# EAGLE design LB_BIT_oX_1IN_1OUT-XXL-v03(1_1x) (EAGLE 6.5.0)
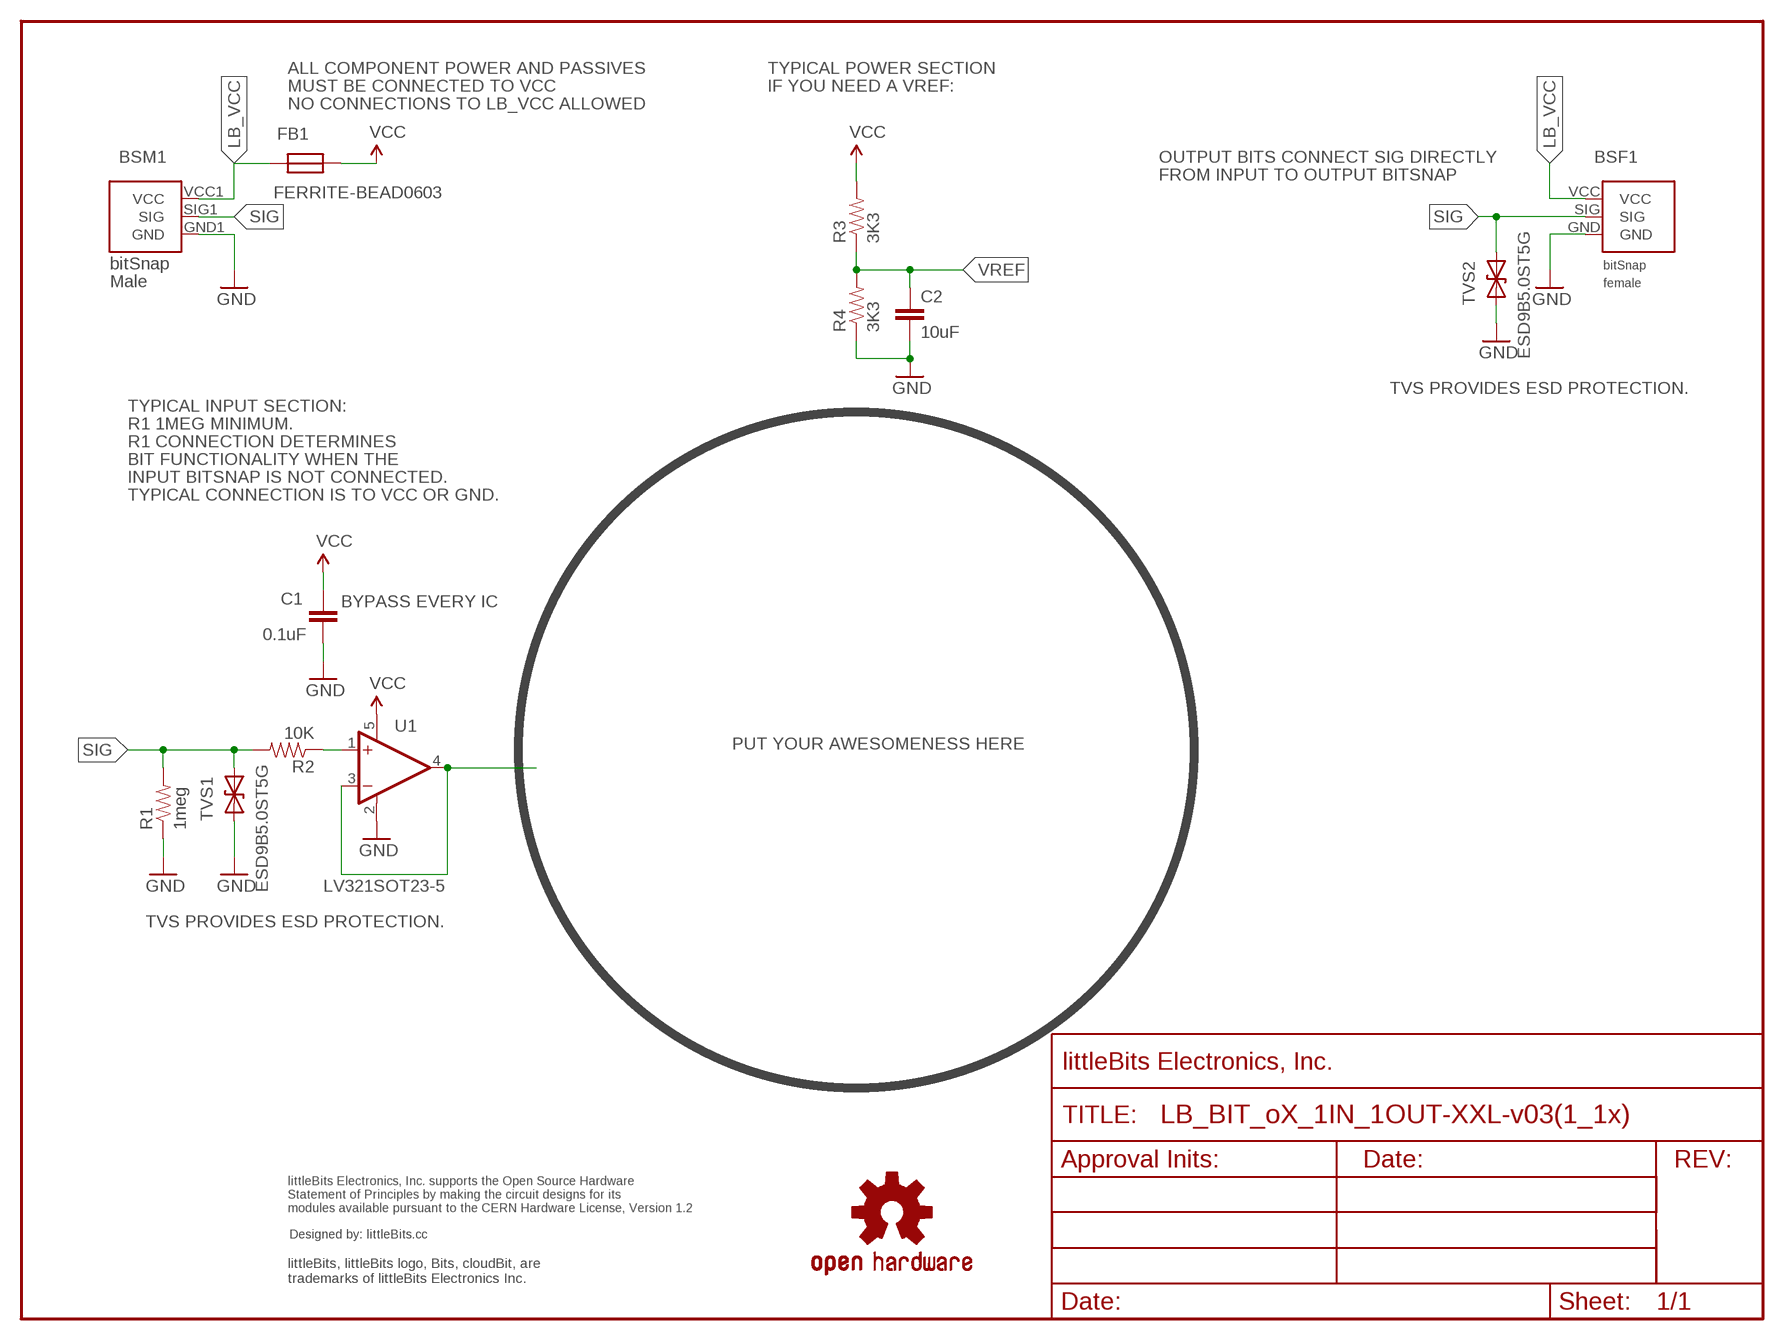
[diagram p0: schematic, sheet 1]

## Parts
BSF1  BITSNAP_V03_FEMALE  [BITSNAP_V03_FEMALE]
BSM1  BITSNAP_V03_MALE  [BITSNAP_V03_MALE]
C1  0.1uF  CAPCAP-0603  [CAP-0603]
C2  10uF  CAPCAP-0603  [CAP-0603]
FB1  FERRITE-BEAD0603  [R0603]
R1  1meg  RESISTOR0603  [RES-0603]
R2  10K  RESISTOR0603  [RES-0603]
R3  3K3  RESISTOR0603  [RES-0603]
R4  3K3  RESISTOR0603  [RES-0603]
TVS1  ESD9B5.0ST5G  DIODE-TVSSOD-923  [SOD-923]
TVS2  ESD9B5.0ST5G  DIODE-TVSSOD-923  [SOD-923]
U1  LV321SOT23-5  [SOT23-5]
U$1  OSHW-LOGOL  [OSHW-LOGO-L]
U$2  OSHWCREDIT  [OSHWCREDIT]
U$3  FRAME-LETTER  [FABDWG01-OHW]

## Nets
GND: BSF1.GND BSM1.GND1(GND) C1.2 C2.2 R1.1 R4.1 TVS1.1(A) TVS2.1(A) U1.2(V-)
LB_VCC: BSF1.VCC BSM1.VCC1(VCC) FB1.2
N$2: U1.3(-IN) U1.4(OUT)
N$4: R2.1 U1.1(+IN)
SIG: BSF1.SIG BSM1.SIG1(SIG) R1.2 R2.2 TVS1.2(C) TVS2.2(C)
VCC: C1.1 FB1.1 R3.2 U1.5(V+)
VREF: C2.1 R3.1 R4.2

## Notes on the sheet
- ALL COMPONENT POWER AND PASSIVES | TYPICAL POWER SECTION
- MUST BE CONNECTED TO VCC | IF YOU NEED A VREF:
- NO CONNECTIONS TO LB_VCC ALLOWED
- OUTPUT BITS CONNECT SIG DIRECTLY
- FROM INPUT TO OUTPUT BITSNAP
- TVS PROVIDES ESD PROTECTION.
- TYPICAL INPUT SECTION:
- R1 1MEG MINIMUM.
- R1 CONNECTION DETERMINES
- BIT FUNCTIONALITY WHEN THE
- INPUT BITSNAP IS NOT CONNECTED.
- TYPICAL CONNECTION IS TO VCC OR GND.
- BYPASS EVERY IC
- PUT YOUR AWESOMENESS HERE
- TVS PROVIDES ESD PROTECTION.

## Library data of the parts
BSF1 = bitSnap:BITSNAP_V03_FEMALE
BSM1 = bitSnap:BITSNAP_V03_MALE
C1 C2 = LITTLEBITS:CAP
FB1 = LITTLEBITS:FERRITE-BEAD
R1-R4 = LITTLEBITS:RESISTOR
TVS1 TVS2 = LITTLEBITS:DIODE-TVS: Bidirectional Transient Voltage Suppression Diode: Device conducts in avalanche mode after reaching a part dependent voltage threshold. Used for limiting voltage spikes on ESD sensitive inputs and outputs.; IEC_ESD_PROT0: +/-18kV; LB_PN: ?; MPN: ESD9B5.0ST5G; V_CLAMP: ?; V_OPERATION: 5V
U1 = LITTLEBITS:LV321
U$1 = LITTLEBITS131206:OSHW-LOGO: Open Source Hardware Logo This logo indicates the piece of hardware it is found on incorporates a OSHW license and/or adheres to the definition of open source hardware found here: http://freedomdefined.org/OSHW
U$2 = LITTLEBITS:OSHWCREDIT
U$3 = LITTLEBITS:FRAME-LETTER

## Board
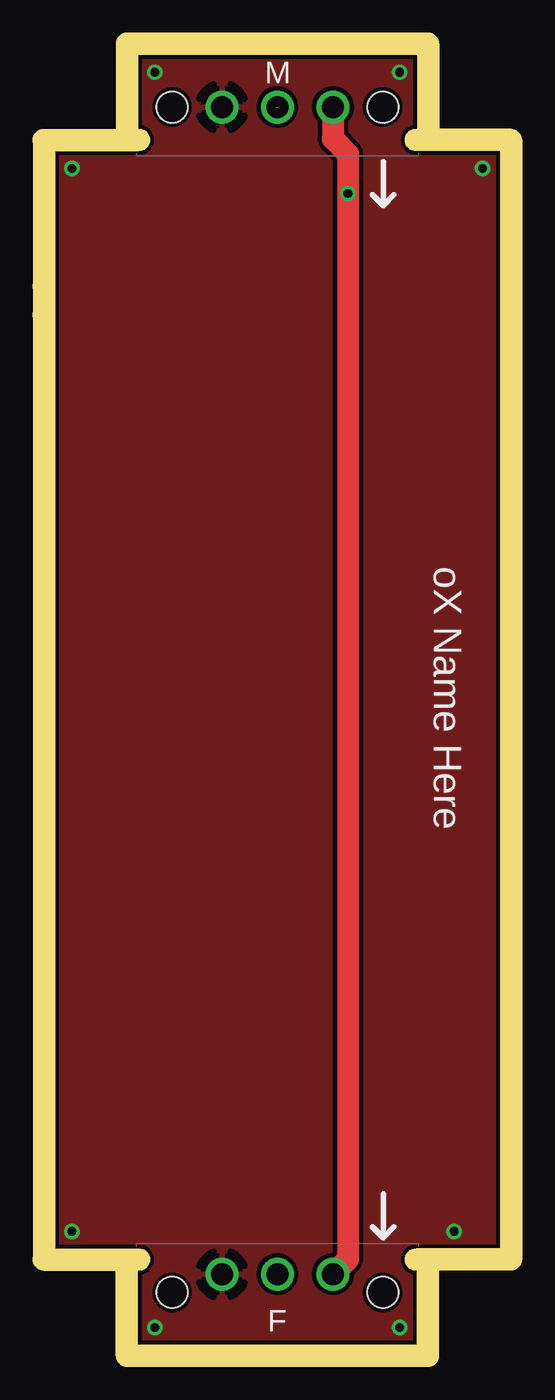
[diagram p1: board, top side]
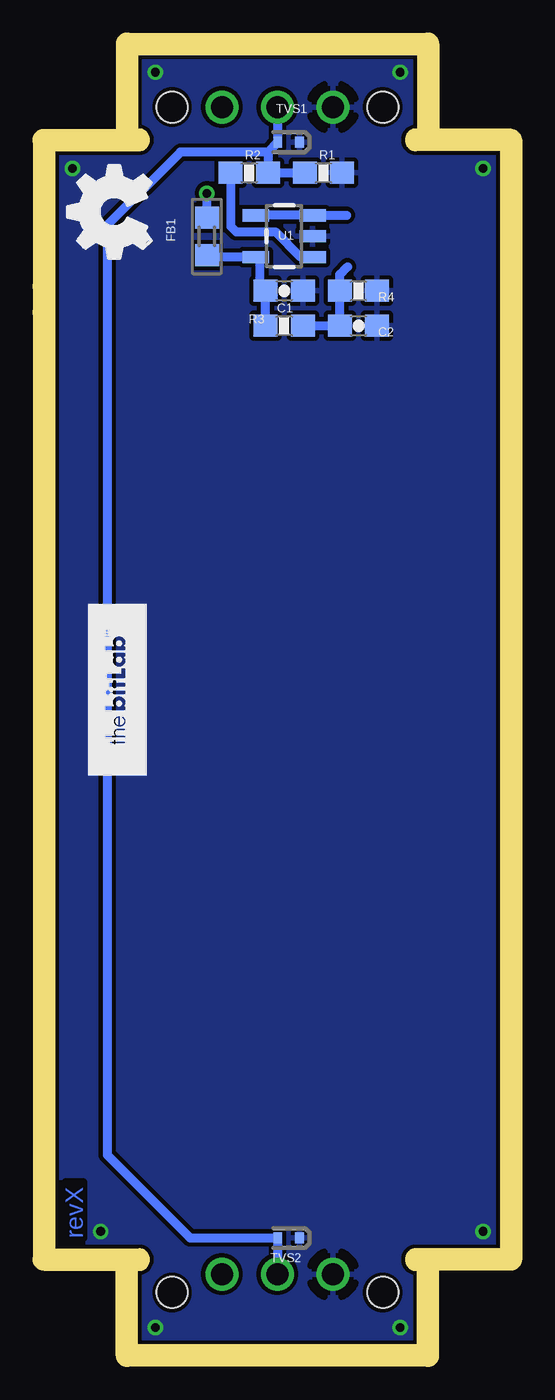
[diagram p2: board, bottom side, seen from below]

Size 20.4 x 59.02 mm. Coordinates in mm from the lower left corner, seen from the top.
Outline: 0,54.62 0,4.4
Outline: 20.4,54.62 20.4,4.4
Copper layers (1*16): Top 0.035mm / dielectric 1.5mm / Bottom 0.035mm
Design rules "default": minimum track width 0.2mm, minimum drill 0.4mm, track to track 0.2mm, track to pad 0.2mm, pad to pad 0.2mm, via to via 0.2mm, smd to smd 0mil, copper to edge 0.2mm, drill to drill 0.2mm, minimum pad ring 0.2mm, minimum via ring 0.15mm, stop-mask expansion 0.1mm, vias tented up to drill 0mil, thermal gap 0.2mm
Milling: 8 lines

### Footprints (pad centres in the part's own frame; a part is rotated, then mirrored left to right if it is on the bottom)
BITSNAP_V03_FEMALE = drill 1: GND 4.065,3.44; SIG 6.605,3.44; VCC 9.145,3.44 | hole 1.4: 1.785,2.61; 11.425,2.61
BITSNAP_V03_MALE = drill 1: GND1 9.145,2.61; SIG1 6.605,2.61; VCC1 4.065,2.61 | hole 1.4: 1.785,2.61; 11.425,2.61
CAP-0603 = smd 1.1 x 1: 1 -0.85,0; 2 0.85,0
R0603 = smd 1 x 1.1: 1 -0.85,0; 2 0.85,0
RES-0603 = smd 1.1 x 1: 1 -0.85,0; 2 0.85,0
SOD-923 = smd 0.4 x 0.5: 1 -0.5,0; 2 0.5,0
SOT23-5 = smd 0.55 x 1.2: 1 -0.95,-1.3; 2 0,-1.3; 3 0.95,-1.3; 4 0.95,1.3; 5 -0.95,1.3

### Placement (x,y rotation side)
BSF1  3.6,-0.21 0 top
BSM1  16.8,59.23 180 top
C1  9.89,48.22 0 bottom
C2  6.49,46.62 0 bottom
FB1  13.43,50.71 90 bottom
R1  8.09,53.62 180 bottom
R2  11.49,53.62 0 bottom
R3  9.89,46.62 180 bottom
R4  6.49,48.22 180 bottom
TVS1  9.69,55.02 180 bottom
TVS2  9.69,4.89 180 bottom
U1  9.89,50.72 90 bottom
U$1  -40.52,-68.43 0 top  (outside the outline)
U$2  -95.25,-64.52 0 top  (outside the outline)
U$3  -3.01,-0.21 0 top  (outside the outline)
U$4  [OSHW_FILLX150_NOTEXT]  15.99,49.71 90 bottom
U$5  [BITLAB-LOGO]  16.19,33.89 270 top

### Tracks (layer width: path | path; a pad name or v marks a point on that pad's centre or on a via)
GND  (via drill 0.4)
  other vias: 4.59,0.79 15.79,0.79 18.29,5.19 19.59,53.82 15.79,58.22 4.59,58.22 0.79,53.82 0.79,5.19
  pour Bottom: 0.02,-0.12 20.41,-0.12 20.41,59.01 0.02,59.01
  pour Top: 0.02,-0.12 20.41,-0.12 20.41,59.01 0.02,59.01
LB_VCC  (via drill 0.4)
  Top 1: BSM1.VCC1 12.74,55.17 13.43,54.48 v13.43,52.68 13.43,3.92 BSF1.VCC
  Bottom 0.406: FB1.2 v13.43,52.68
N$2
  Bottom 0.406: U1.4 U1.3 7.04,51.67
N$4
  Bottom 0.406: R2.1 12.34,51.17 12.09,50.92 10.29,50.92 9.14,49.77 U1.1
SIG  (1 unrouted)
  Bottom 0.406: R1.2 R2.2 10.64,54.57 | 10.19,56.62 TVS1.2 10.64,54.57 | 10.64,54.57 14.64,54.57 17.99,51.22 17.99,8.69 14.19,4.89 TVS2.2 BSF1.SIG
VCC
  Bottom 0.406: U1.5 13.33,49.77 FB1.1 | U1.5 11.14,49.72 | 10.74,48.17 C1.1 | U1.5 10.99,49.77 10.99,48.32 C1.1 | R3.2 C1.1
VREF
  Bottom 0.406: R3.1 C2.1 R4.2 7.34,48.97 6.99,49.32

### Text on the board
Bottom: revX
tPlace: oX Name Here